# Altium schematic sheet TMouseCursor.schDoc: LiveDesign Evaluation - Video Windows
size A4; Organization: Altium Limited; Address1: L3, 12a Rodborough Rd; Address2: Frenchs Forest; Address3: NSW; Address4: Australia 2086; DocumentNumber: 11; SheetNumber: 11; SheetTotal: 20
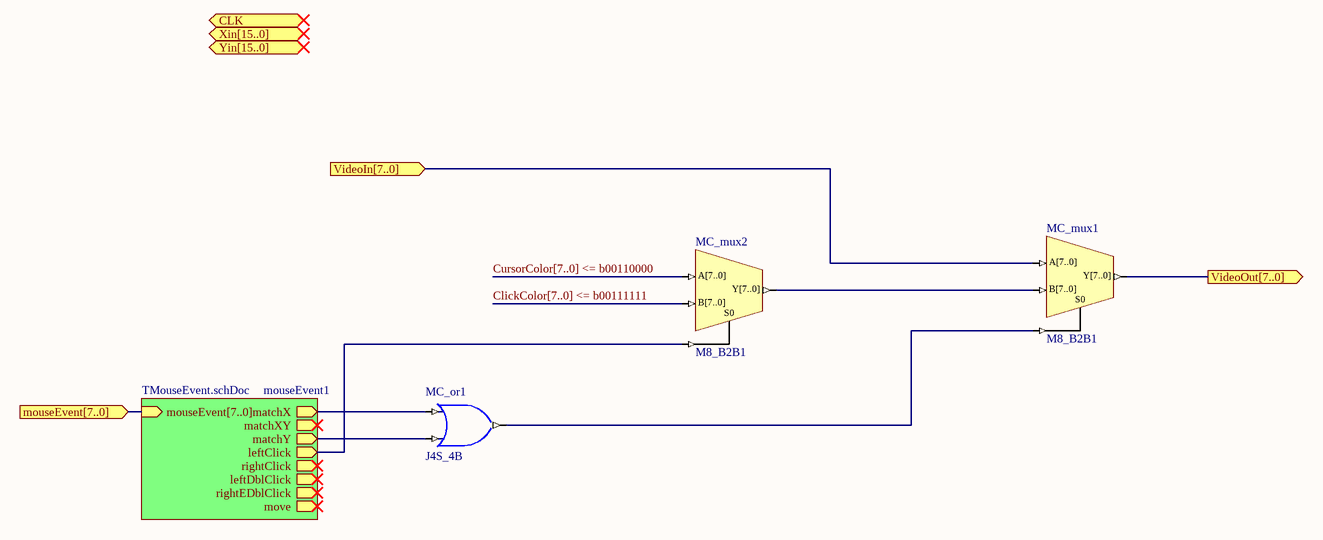
[diagram p0: TMouseCursor.schDoc]

## Parts
MC_mux1  M8_B2B1
MC_mux2  M8_B2B1
MC_or1  J4S_4B

## Sub-sheets
mouseEvent1 = TMouseEvent.schDoc: mouseEvent[7..0] (in), matchX (out), matchXY (out), matchY (out), leftClick (out), rightClick (out), leftDblClick (out), rightEDblClick (out), move (out)

## Ports
CLK (in), mouseEvent[7..0] (in), VideoIn[7..0] (in), VideoOut[7..0] (out), Xin[15..0] (in), Yin[15..0] (in)

## Nets
ClickColor[7..0] <= b00111111: MC_mux2.B[7..0]
CursorColor[7..0] <= b00110000: MC_mux2.A[7..0]
VideoIn[7..0]: MC_mux1.A[7..0] ; port VideoIn[7..0]
VideoOut[7..0]: MC_mux1.Y[7..0] ; port VideoOut[7..0]
NetMC_mux1_B[7..0]: MC_mux1.B[7..0] MC_mux2.Y[7..0]
NetMC_mux1_S0: MC_mux1.S0 MC_or1.O
NetMC_mux2_S0: MC_mux2.S0 ; sheet mouseEvent1/leftClick
NetMC_or1_I0: MC_or1.I0 ; sheet mouseEvent1/matchX
NetMC_or1_I1: MC_or1.I1 ; sheet mouseEvent1/matchY

## Buses and harness runs
bus ClickColor[7..0] <= b00111111
bus CursorColor[7..0] <= b00110000
bus port mouseEvent[7..0] = sheet mouseEvent1/mouseEvent[7..0]

## Notes on the sheet
- Title
- Size:
- Date:
- A4
- Number:
- Time:
- Revision:
- Sheet
- of
- File:

## Library data of the parts
MC_mux1 MC_mux2 = M8_B2B1: 2x8-Bit Bus to 1x8-Bit Bus Multiplexer; ArchiveName: GENERIC; Published: 9-30-2003; Publisher: Altium Limited; Core Revision: 1.00.00
MC_or1 = OR2S: 2-Input OR Gate, Single Pin Version; Xilinx Equivalent: OR2; ArchiveName: GENERIC; Published: 9-30-2003; Publisher: Altium Limited; Core Revision: 1.00.00